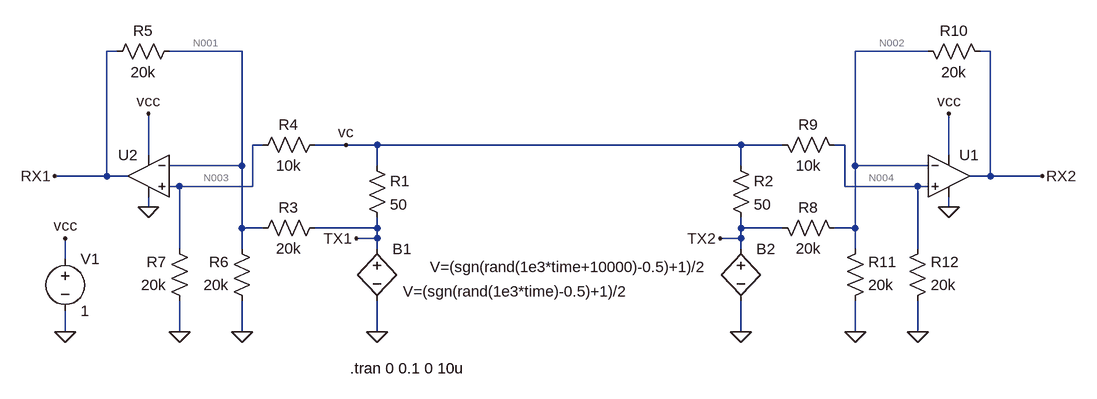
[diagram p0: schematic hybrid.asc]
hybrid.asc, the LTspice schematic file:
Version 4
SHEET 1 992 680
WIRE -672 -160 -688 -160
WIRE -480 -160 -592 -160
WIRE 576 -160 464 -160
WIRE 672 -160 656 -160
WIRE -448 -16 -464 -16
WIRE -320 -16 -368 -16
WIRE -272 -16 -320 -16
WIRE 288 -16 -272 -16
WIRE 352 -16 288 -16
WIRE 448 -16 432 -16
WIRE -624 0 -624 -64
WIRE 608 0 608 -64
WIRE -480 16 -480 -160
WIRE -480 16 -592 16
WIRE -272 16 -272 -16
WIRE 288 16 288 -16
WIRE 464 16 464 -160
WIRE 576 16 464 16
WIRE -688 32 -688 -160
WIRE -688 32 -768 32
WIRE -656 32 -688 32
WIRE 672 32 672 -160
WIRE 672 32 640 32
WIRE 752 32 672 32
WIRE -576 48 -592 48
WIRE -464 48 -464 -16
WIRE -464 48 -576 48
WIRE 448 48 448 -16
WIRE 560 48 448 48
WIRE 576 48 560 48
WIRE -624 80 -624 64
WIRE 608 80 608 64
WIRE -480 112 -480 16
WIRE -448 112 -480 112
WIRE -272 112 -272 96
WIRE -272 112 -368 112
WIRE 288 112 288 96
WIRE 352 112 288 112
WIRE 464 112 464 16
WIRE 464 112 432 112
WIRE -272 128 -272 112
WIRE -272 128 -304 128
WIRE 288 128 288 112
WIRE 288 128 256 128
WIRE -576 144 -576 48
WIRE -480 144 -480 112
WIRE -272 144 -272 128
WIRE 288 144 288 128
WIRE 464 144 464 112
WIRE 560 144 560 48
WIRE -752 160 -752 128
WIRE -752 272 -752 240
WIRE -576 272 -576 224
WIRE -480 272 -480 224
WIRE -272 272 -272 224
WIRE 288 272 288 224
WIRE 464 272 464 224
WIRE 560 272 560 224
FLAG -272 272 0
FLAG -624 80 0
FLAG 288 272 0
FLAG -304 128 TX1
FLAG 256 128 TX2
FLAG -624 -64 vcc
FLAG -752 128 vcc
FLAG -752 272 0
FLAG -480 272 0
FLAG -320 -16 vc
FLAG -768 32 RX1
FLAG -576 272 0
FLAG 608 80 0
FLAG 608 -64 vcc
FLAG 464 272 0
FLAG 752 32 RX2
FLAG 560 272 0
SYMBOL OpAmps\\UniversalOpAmp2 -624 32 M0
SYMATTR InstName U2
SYMBOL bv -272 128 R0
WINDOW 3 40 82 Left 2
SYMATTR InstName B1
SYMATTR Value V=(sgn(rand(1e3*time)-0.5)+1)/2
SYMBOL bv 288 128 R0
WINDOW 3 -44 44 Right 2
SYMATTR InstName B2
SYMATTR Value V=(sgn(rand(1e3*time+10000)-0.5)+1)/2
SYMBOL res -288 0 R0
SYMATTR InstName R1
SYMATTR Value 50
SYMBOL res 272 0 R0
SYMATTR InstName R2
SYMATTR Value 50
SYMBOL voltage -752 144 R0
WINDOW 123 0 0 Left 0
WINDOW 39 0 0 Left 0
SYMATTR InstName V1
SYMATTR Value 1
SYMBOL res -352 96 R90
WINDOW 0 0 56 VBottom 2
WINDOW 3 32 56 VTop 2
SYMATTR InstName R3
SYMATTR Value 20k
SYMBOL res -352 -32 R90
WINDOW 0 0 56 VBottom 2
WINDOW 3 32 56 VTop 2
SYMATTR InstName R4
SYMATTR Value 10k
SYMBOL res -576 -176 R90
WINDOW 0 0 56 VBottom 2
WINDOW 3 32 56 VTop 2
SYMATTR InstName R5
SYMATTR Value 20k
SYMBOL res -464 240 R180
WINDOW 0 36 76 Left 2
WINDOW 3 36 40 Left 2
SYMATTR InstName R6
SYMATTR Value 20k
SYMBOL res -560 240 R180
WINDOW 0 36 76 Left 2
WINDOW 3 36 40 Left 2
SYMATTR InstName R7
SYMATTR Value 20k
SYMBOL OpAmps\\UniversalOpAmp2 608 32 R0
SYMATTR InstName U1
SYMBOL res 336 96 M90
WINDOW 0 0 56 VBottom 2
WINDOW 3 32 56 VTop 2
SYMATTR InstName R8
SYMATTR Value 20k
SYMBOL res 336 -32 M90
WINDOW 0 0 56 VBottom 2
WINDOW 3 32 56 VTop 2
SYMATTR InstName R9
SYMATTR Value 10k
SYMBOL res 560 -176 M90
WINDOW 0 0 56 VBottom 2
WINDOW 3 32 56 VTop 2
SYMATTR InstName R10
SYMATTR Value 20k
SYMBOL res 448 240 M180
WINDOW 0 36 76 Left 2
WINDOW 3 36 40 Left 2
SYMATTR InstName R11
SYMATTR Value 20k
SYMBOL res 544 240 M180
WINDOW 0 36 76 Left 2
WINDOW 3 36 40 Left 2
SYMATTR InstName R12
SYMATTR Value 20k
TEXT -314 328 Left 2 !.tran 0 0.1 0 10u

The netlist it stands for:
* hybrid.asc
XU2 N003 N001 vcc 0 RX1 level2 Avol=1Meg GBW=10Meg Slew=10Meg Ilimit=25m Rail=0 Vos=0 En=0 Enk=0 In=0 Ink=0 Rin=500Meg  ; pins In+ In- V+ V- OUT
B1 TX1 0 V=(sgn(rand(1e3*time)-0.5)+1)/2
B2 TX2 0 V=(sgn(rand(1e3*time+10000)-0.5)+1)/2
R1 vc TX1 50
R2 vc TX2 50
V1 vcc 0 1
R3 TX1 N001 20k
R4 vc N003 10k
R5 N001 RX1 20k
R6 0 N001 20k
R7 0 N003 20k
XU1 N004 N002 vcc 0 RX2 level2 Avol=1Meg GBW=10Meg Slew=10Meg Ilimit=25m Rail=0 Vos=0 En=0 Enk=0 In=0 Ink=0 Rin=500Meg  ; pins In+ In- V+ V- OUT
R8 TX2 N002 20k
R9 vc N004 10k
R10 N002 RX2 20k
R11 0 N002 20k
R12 0 N004 20k
.tran 0 0.1 0 10u
.lib UniversalOpAmp2.lib
.backanno
.end

* Results of the author's LTspice run, read from the files saved beside the schematic
* Operating Point, zero values left out:
*   V(rx1) = 181.7 µV
*   V(vcc) = 1 V
*   V(n001) = 166.7 mV
*   V(n003) = 166.4 mV
*   V(tx1) = 500 mV
*   V(vc) = 249.6 mV
*   V(rx2) = 499.2 mV
*   V(n002) = 166.4 mV
*   V(n004) = 166.4 mV
*   I(B2) = 5 mA
*   I(B1) = -5.025 mA
*   I(R12) = -8.32 µA
*   I(R11) = -8.32 µA
*   I(R10) = -16.64 µA
*   I(R9) = 8.319 µA
*   I(R8) = -8.32 µA
*   I(R7) = -8.32 µA
*   I(R6) = -8.337 µA
*   I(R5) = 8.327 µA
*   I(R4) = 8.319 µA
*   I(R3) = 16.66 µA
*   I(R2) = 4.992 mA
*   I(R1) = -5.008 mA
*   I(V1) = -59.23 µA
*   Ix(u2:1) = -667.2 pA
*   Ix(u2:2) = -666.5 pA
*   Ix(u2:3) = 222.3 nA
*   Ix(u2:4) = -8.538 µA
*   Ix(u2:5) = 8.327 µA
*   Ix(u1:1) = -667.2 pA
*   Ix(u1:2) = -667.2 pA
*   Ix(u1:3) = 59.01 µA
*   Ix(u1:4) = -42.37 µA
*   Ix(u1:5) = -16.64 µA
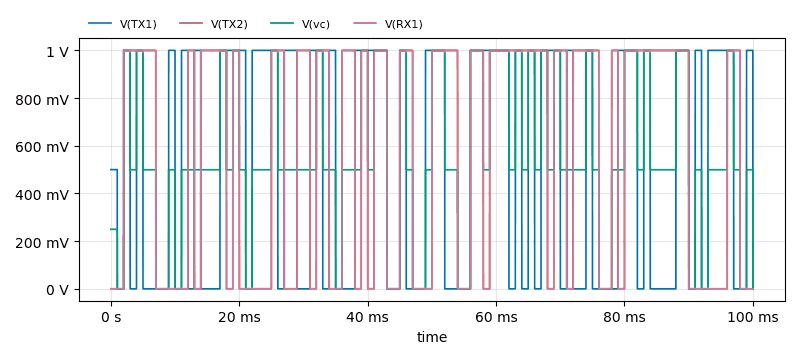
[diagram p1: Transient Analysis of hybrid.asc, plotted from the saved traces]
* Transient Analysis, 1 run:
*   V(TX1): min 0 V, max 1 V, average 525 mV, rms 722.8 mV, last 0 V
*   V(TX2): min 0 V, max 1 V, average 580 mV, rms 761.6 mV, last 0 V
*   V(vc): min 0 V, max 998.3 mV, average 551.6 mV, rms 643.6 mV, last 0 V
*   V(RX1): min 2.978 µV, max 999 mV, average 578.6 mV, rms 759.6 mV, last 13.71 µV